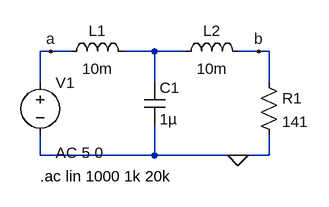
[diagram p0: schematic lab_5.asc]
lab_5.asc, the LTspice schematic file:
Version 4
SHEET 1 880 680
WIRE 0 80 -16 80
WIRE 32 80 0 80
WIRE 160 80 112 80
WIRE 208 80 160 80
WIRE 320 80 288 80
WIRE 336 80 320 80
WIRE -16 128 -16 80
WIRE 160 128 160 80
WIRE 336 128 336 80
WIRE -16 240 -16 208
WIRE 160 240 160 192
WIRE 160 240 -16 240
WIRE 288 240 160 240
WIRE 336 240 336 208
WIRE 336 240 288 240
FLAG 288 240 0
FLAG 0 80 a
FLAG 320 80 b
SYMBOL cap 144 128 R0
SYMATTR InstName C1
SYMATTR Value 1µ
SYMBOL ind 16 96 R270
WINDOW 0 32 56 VTop 2
WINDOW 3 5 56 VBottom 2
SYMATTR InstName L1
SYMATTR Value 10m
SYMATTR SpiceLine Rser=28
SYMBOL ind 192 96 R270
WINDOW 0 32 56 VTop 2
WINDOW 3 5 56 VBottom 2
SYMATTR InstName L2
SYMATTR Value 10m
SYMATTR SpiceLine Rser=28
SYMBOL voltage -16 112 R0
WINDOW 123 24 124 Left 2
WINDOW 39 0 0 Left 0
SYMATTR InstName V1
SYMATTR Value ""
SYMATTR Value2 AC 5 0
SYMBOL res 320 112 R0
SYMATTR InstName R1
SYMATTR Value 141
TEXT -16 272 Left 2 !.ac lin 1000 1k 20k

The netlist it stands for:
* lab_5.asc
C1 N001 0 1µ
L1 a N001 10m Rser=28
L2 N001 b 10m Rser=28
V1 a 0 AC 5 0
R1 b 0 141
.ac lin 1000 1k 20k
.backanno
.end